# EAGLE design 2x6x1.27mm-pogo-adapter-flipped-mk-1.0.2 (EAGLE 9.2.2)
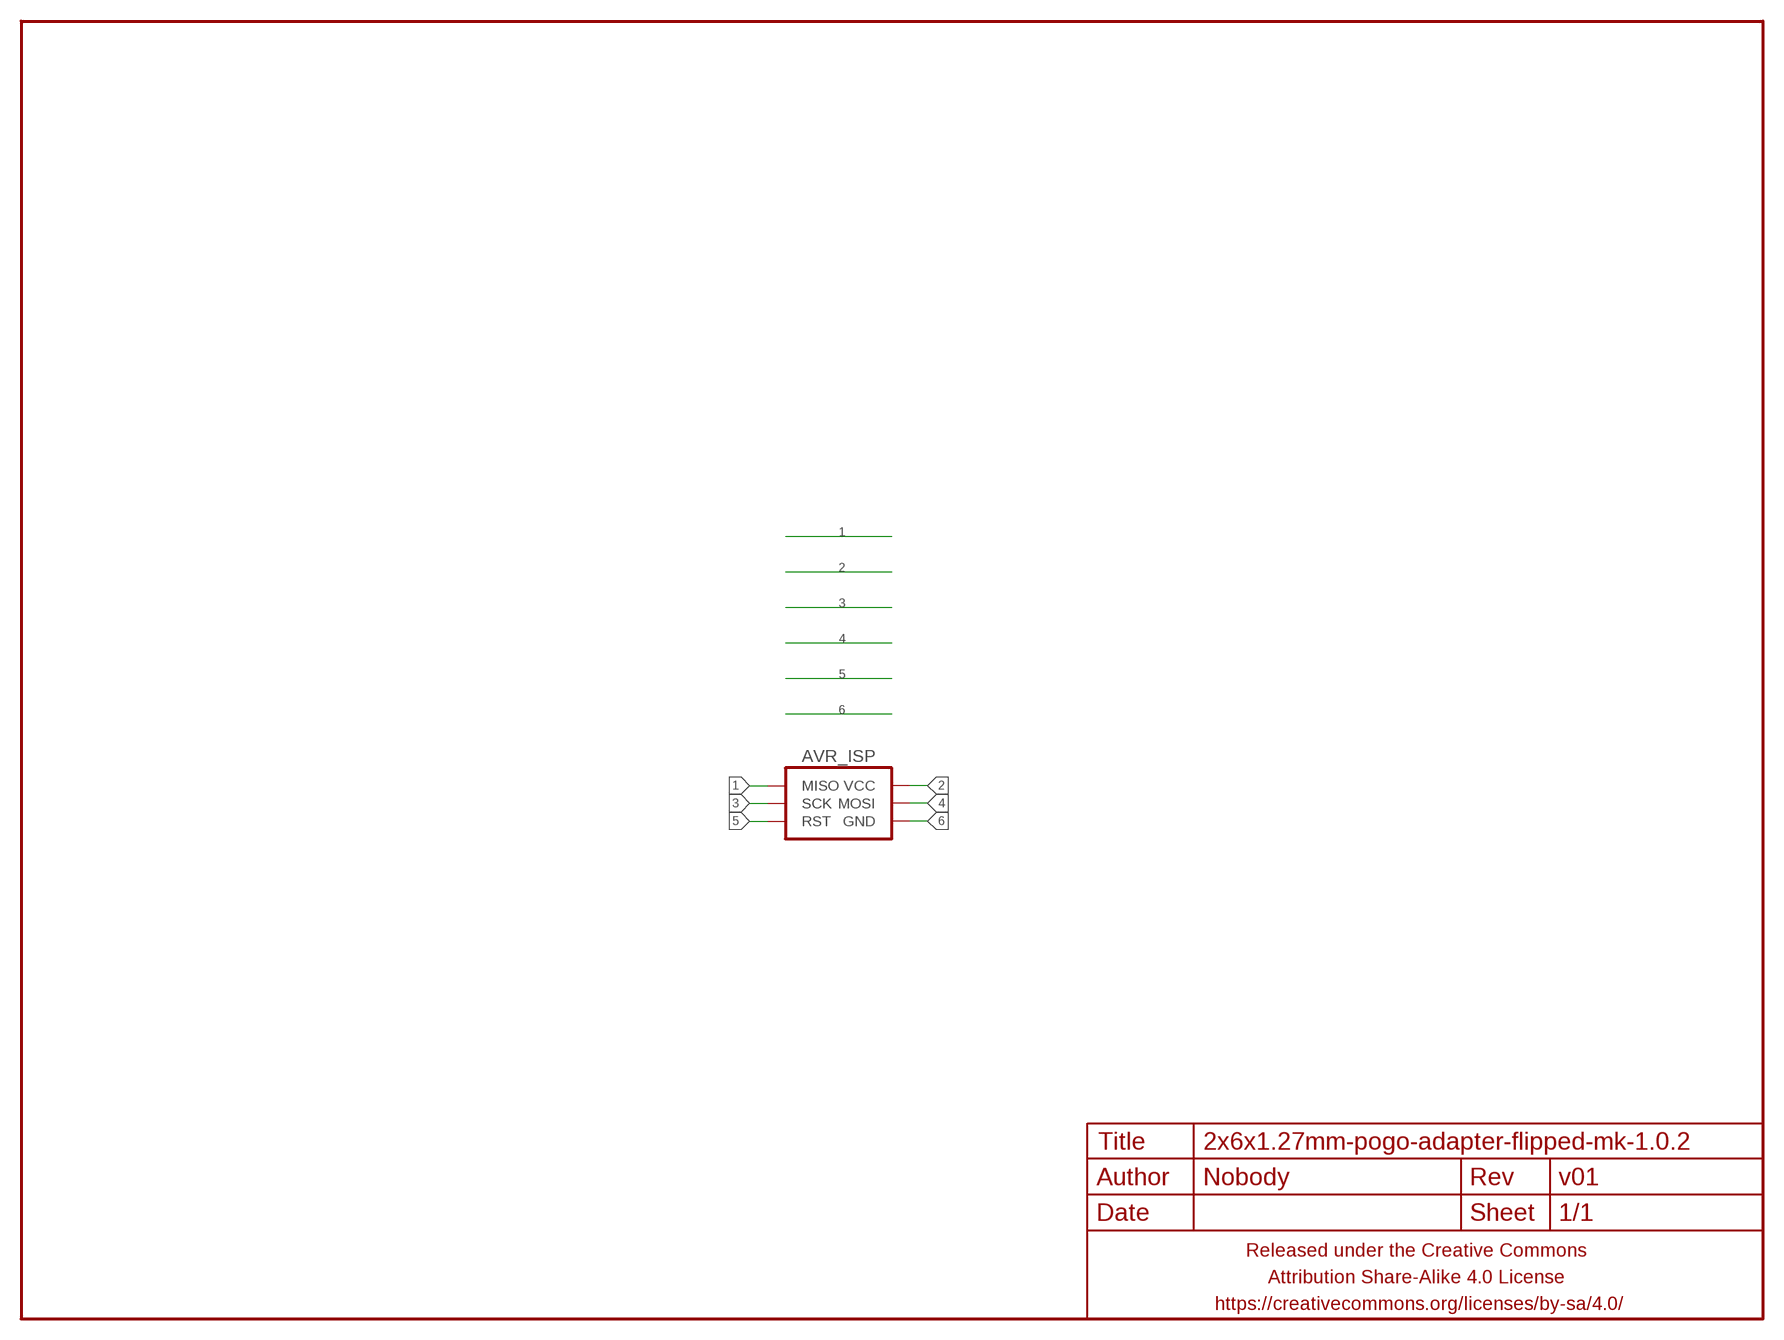
[diagram p0: schematic, sheet 1]

## Parts
AVR_ISP  AVR_SPI_PRG_62X3_SMD  [2X3_SMD]
FRAME1  FRAME-LETTERNO_PACKAGE  [DUMMY]

## Nets
1: AVR_ISP.1(MISO)
2: AVR_ISP.2(VCC)
3: AVR_ISP.3(SCK)
4: AVR_ISP.4(MOSI)
5: AVR_ISP.5(RST)
6: AVR_ISP.6(GND)

## Library data of the parts
AVR_ISP = a_parts:AVR_SPI_PRG_6: AVR ISP 6 Pin This is the reduced ISP connector for AVR programming. Common on Arduino. This footprint will take up less PCB space and can be used with a 10-pin to 6-pin adapter such as SKU: BOB-08508 **Special note about "TEST_POINT" package. The stop mask is on the top side, so if you want your programming test points to be on the bottom of your board, make sure to place this package on the bottom side of the board. This also ensure that the orientation to program from the bottom side will be correct.
FRAME1 = a_parts:FRAME-LETTER: Schematic Frame Standard 8.5x11 US Letter frame; DESIGNER: Nobody; VERSION: v01

## Board
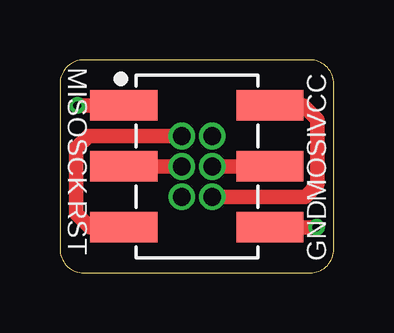
[diagram p1: board, top side]
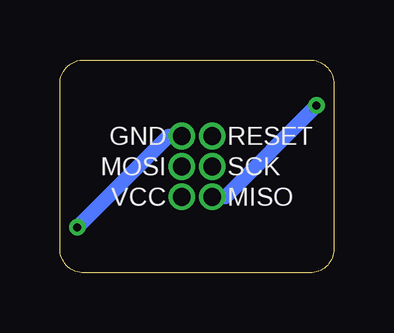
[diagram p2: board, bottom side, seen from below]

Size 11.43 x 8.89 mm. Coordinates in mm from the lower left corner, seen from the top.
Outline: 0,7.89 0,1 arc90 1,0 10.43,0 arc90 11.43,1 11.43,7.89 arc90 10.43,8.89 1,8.89 arc90 0,7.89
Copper layers (1*16): Top 0.0356mm / dielectric 1.5011mm / Bottom 0.0356mm
Design rules "LaenPCBOrder_2": minimum track width 6mil, minimum drill 13mil, track to track 6mil, track to pad 6mil, pad to pad 6mil, via to via 6mil, smd to smd 6mil, copper to edge 15mil, drill to drill 6mil, minimum pad ring 7mil, minimum via ring 7mil, stop-mask expansion 3mil, vias tented up to drill 20mil, thermal gap 10mil

### Footprints (pad centres in the part's own frame; a part is rotated, then mirrored left to right if it is on the bottom)
2X3_SMD = smd 1.27 x 2.794: 1 -2.54,-3.048; 2 -2.54,3.048; 3 0,-3.048; 4 0,3.048; 5 2.54,-3.048; 6 2.54,3.048

### Placement (x,y rotation side)
AVR_ISP  5.71,4.45 270 top
FRAME1  0,0 0 top

### Tracks (layer width: path | path; a pad name or v marks a point on that pad's centre or on a via)
1  (via drill 0.33, 0.74)
  Top 0.61: AVR_ISP.1 v0.72,6.99
  Bottom 0.61: v0.72,6.99 4.53,3.17 v5.08,3.17
2  (via drill 0.74)
  Top 0.61: AVR_ISP.2 10.16,6.99 10.74,6.4 10.74,3.68 10.24,3.17 v6.35,3.17
3  (via drill 0.74)
  Top 0.61: AVR_ISP.3 v5.08,4.45
4  (via drill 0.74)
  Top 0.61: AVR_ISP.4 v6.35,4.45
5  (via drill 0.74)
  Top 0.61: AVR_ISP.5 1.27,1.91 0.69,2.49 0.69,5.21 1.19,5.71 v5.08,5.71
6  (via drill 0.33, 0.74)
  Top 0.61: AVR_ISP.6 v10.71,1.91
  Bottom 0.61: v10.71,1.91 6.9,5.71 v6.35,5.71

### Text on the board
bPlace: RESET | GND | SCK | MOSI | MISO | VCC
tNames: MISO | VCC | SCK | MOSI | RST | GND